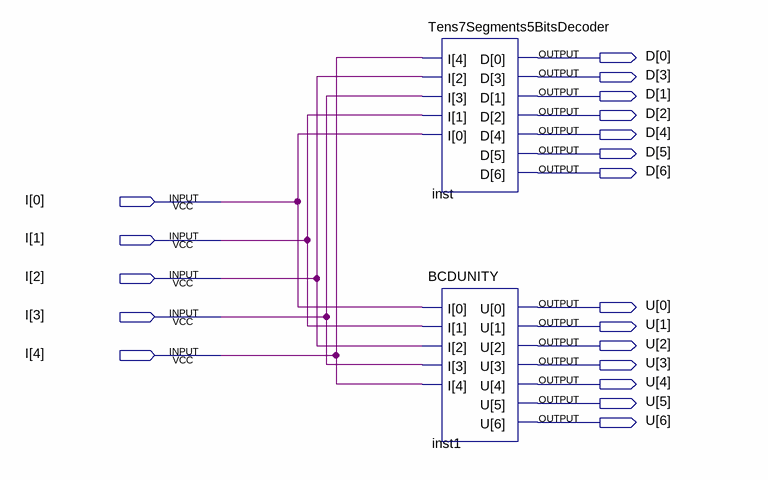
[diagram p0: schematic sheet]
// Quartus schematic BinaryToDecimalBCDConversor.bdf as structural Verilog: 2 symbols, 19 pins
module BinaryToDecimalBCDConversor (
  input  [4:0] I,
  output [6:0] D,
  output [6:0] U
);

  Tens7Segments5BitsDecoder inst (.I(I), .D(D));
  BCDUNITY inst1 (.I(I), .U(U));
endmodule
